# Altium schematic sheet McMaster.SchDoc
size A
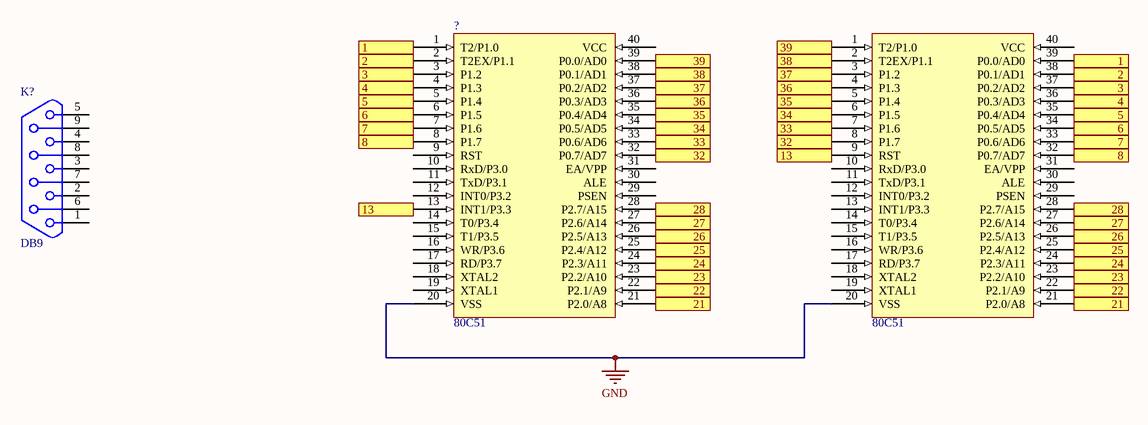
[diagram p0: McMaster.SchDoc]

## Parts
(Parts that share a designator on the sheet are numbered #1, #2 ... from top to bottom, then left to right.)
?#1  80C51  [PCBComponent_1]
?#2  80C51  [PCBComponent_1]
K?  DB9  [DB9SLE]

## Ports
1, 2, 3, 4, 5, 6, 7, 8, 13, 21, 22, 23, 24, 25, 26, 27, 28, 32, 33, 34, 35, 36, 37, 38, 39

## Nets
GND: ?#1.20(VSS) ?#2.20(VSS)
1: ?#1.1(T2/P1.0) ?#2.39(P0.0/AD0) ; port 1
2: ?#1.2(T2EX/P1.1) ?#2.38(P0.1/AD1) ; port 2
3: ?#1.3(P1.2) ?#2.37(P0.2/AD2) ; port 3
4: ?#1.4(P1.3) ?#2.36(P0.3/AD3) ; port 4
5: ?#1.5(P1.4) ?#2.35(P0.4/AD4) ; port 5
6: ?#1.6(P1.5) ?#2.34(P0.5/AD5) ; port 6
7: ?#1.7(P1.6) ?#2.33(P0.6/AD6) ; port 7
8: ?#1.8(P1.7) ?#2.32(P0.7/AD7) ; port 8
13: ?#1.13(INT1/P3.3) ?#2.9(RST) ; port 13
21: ?#1.21(P2.0/A8) ?#2.21(P2.0/A8) ; port 21
22: ?#1.22(P2.1/A9) ?#2.22(P2.1/A9) ; port 22
23: ?#1.23(P2.2/A10) ?#2.23(P2.2/A10) ; port 23
24: ?#1.24(P2.3/A11) ?#2.24(P2.3/A11) ; port 24
25: ?#1.25(P2.4/A12) ?#2.25(P2.4/A12) ; port 25
26: ?#1.26(P2.5/A13) ?#2.26(P2.5/A13) ; port 26
27: ?#1.27(P2.6/A14) ?#2.27(P2.6/A14) ; port 27
28: ?#1.28(P2.7/A15) ?#2.28(P2.7/A15) ; port 28
32: ?#1.32(P0.7/AD7) ?#2.8(P1.7) ; port 32
33: ?#1.33(P0.6/AD6) ?#2.7(P1.6) ; port 33
34: ?#1.34(P0.5/AD5) ?#2.6(P1.5) ; port 34
35: ?#1.35(P0.4/AD4) ?#2.5(P1.4) ; port 35
36: ?#1.36(P0.3/AD3) ?#2.4(P1.3) ; port 36
37: ?#1.37(P0.2/AD2) ?#2.3(P1.2) ; port 37
38: ?#1.38(P0.1/AD1) ?#2.2(T2EX/P1.1) ; port 38
39: ?#1.39(P0.0/AD0) ?#2.1(T2/P1.0) ; port 39

Not connected (* = marked no-connect by the designer): ?#1 9(RST) 10(RxD/P3.0) 11(TxD/P3.1) 12(INT0/P3.2) 14(T0/P3.4) 15(T1/P3.5) 16(WR/P3.6) 17(RD/P3.7) 18(XTAL2) 19(XTAL1) 29(PSEN) 30(ALE) 31(EA/VPP) 40(VCC); ?#2 10(RxD/P3.0) 11(TxD/P3.1) 12(INT0/P3.2) 13(INT1/P3.3) 14(T0/P3.4) 15(T1/P3.5) 16(WR/P3.6) 17(RD/P3.7) 18(XTAL2) 19(XTAL1) 29(PSEN) 30(ALE) 31(EA/VPP) 40(VCC); K? 1 2 3 4 5 6 7 8 9